# Altium schematic sheet 2025-565-V1.SchDoc
size A2; PageSetup: Record=PageOptions|CenterHorizontal=True|CenterVertical=True|PrintScale=0.52|XCorrection=1.00|YCorrection=1.00|PrintKind=0|BorderSize=5000000|LeftOffset=0|BottomOffset=0|Orientation=2|PaperLength=1000|PaperWidth=1000|Scale=100|PaperSource=7|PrintQuality=-3|MediaType=1|DitherType=10|PrintScaleMode=1|PaperKind=A4|PaperIndex=9
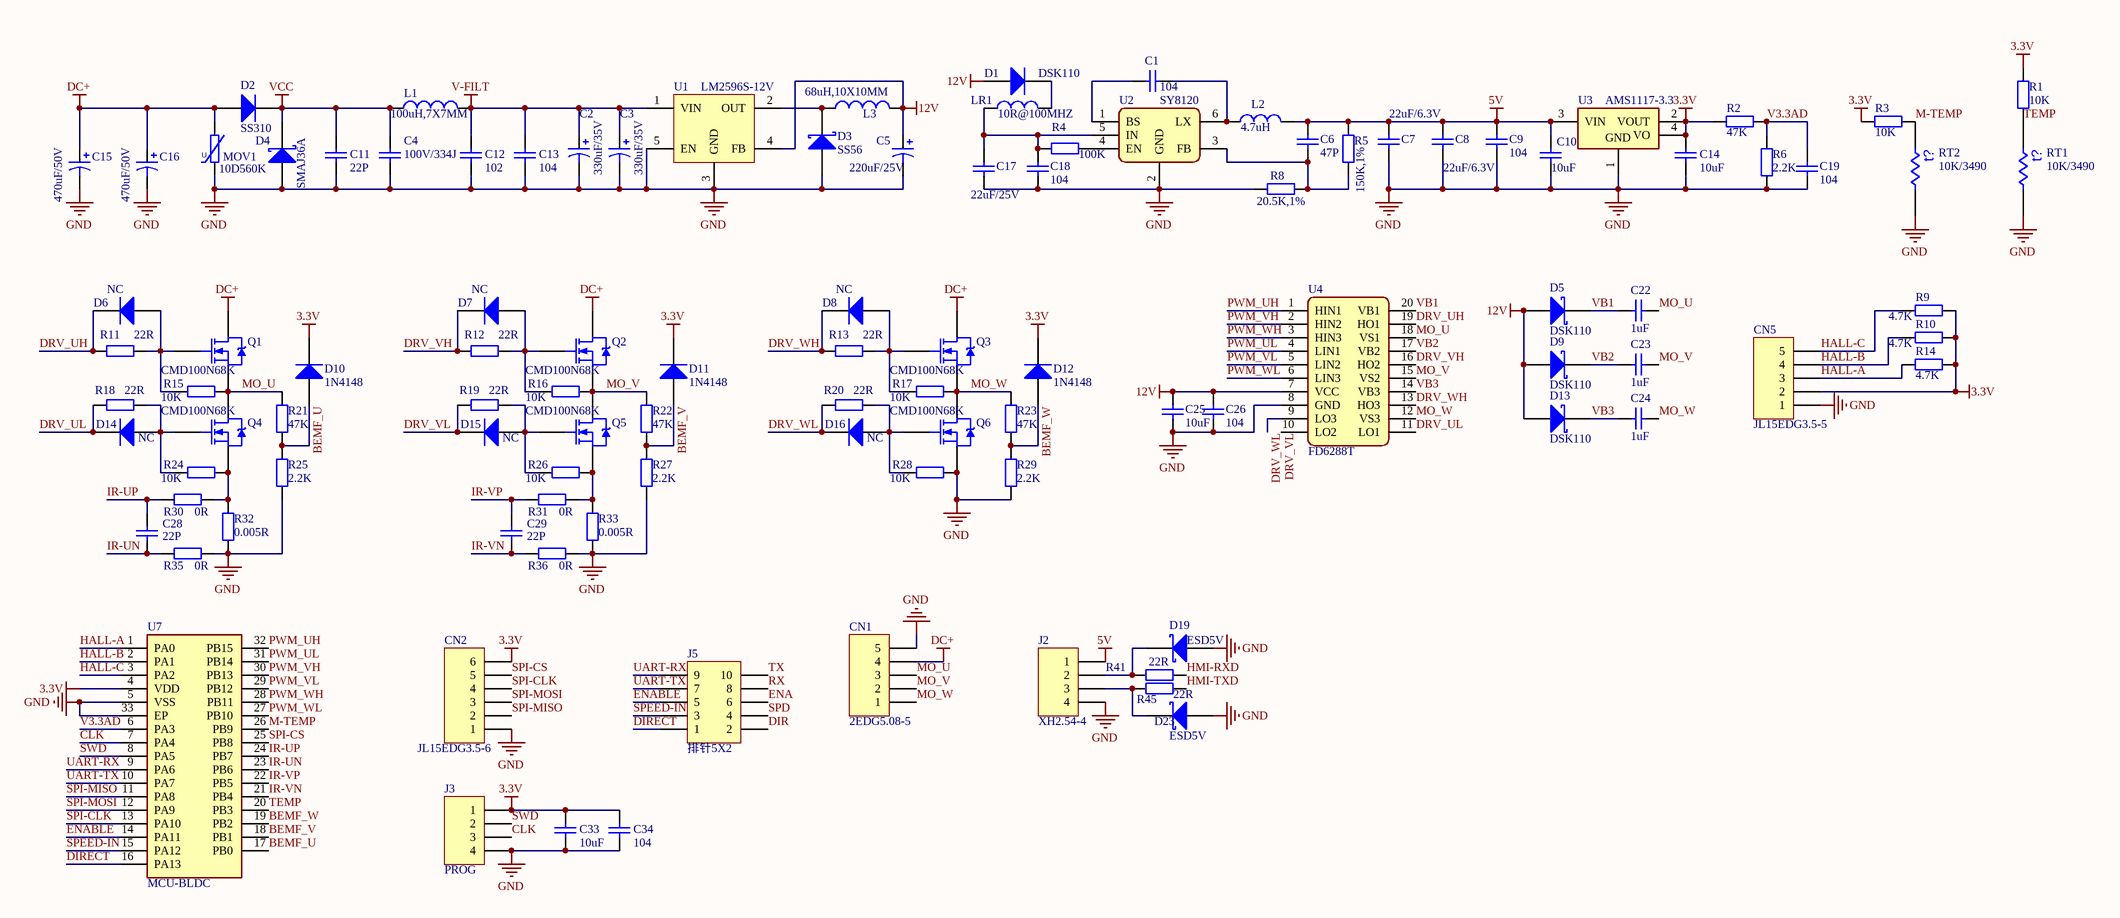
[diagram p0: 2025-565-V1.SchDoc]

## Parts
C1  104  [0603-C]
C2  330uF/35V  [EC10-V5]
C3  330uF/35V  [EC10-V5]
C4  100V/334J  [CAP5-7.2X7.5X3.5]
C5  220uF/25V  [CAP_63*77]
C6  47P  [0603-C]
C7  22uF/6.3V  [0603-C]
C8  22uF/6.3V  [0603-C]
C9  104  [0603-C]
C10  10uF  [0603-C]
C11  22P  [0603-C]
C12  102  [0603-C]
C13  104  [0603-C]
C14  10uF  [0603-C]
C15  470uF/50V  [EC10-V5]
C16  470uF/50V  [EC10-V5]
C17  22uF/25V  [1206-C]
C18  104  [0603-C]
C19  104  [0603-C]
C22  1uF  [0603-C]
C23  1uF  [0603-C]
C24  1uF  [0603-C]
C25  10uF  [1206-R]
C26  104  [0603-C]
C28  22P  [0603-C]
C29  22P  [0603-C]
C33  10uF  [0603-C]
C34  104  [0603-C]
CN1  2EDG5.08-5  [CON5_5.08MM_2EDG]
CN2  JL15EDG3.5-6  [CON3.5*6-H-SPEC]
CN5  JL15EDG3.5-5  [CON3.5*5-H-SPEC]
D1  DSK110  [SOD-123FL]
D2  SS310  [SMA-DO-214AC]
D3  SS56  [SMB_DO-214AA]
D4  SMAJ36A  [SMA-DO-214AC]
D5  DSK110  [SOD-123FL]
D6  NC  [SOD-123]
D7  NC  [SOD-123]
D8  NC  [SOD-123]
D9  DSK110  [SOD-123FL]
D10  1N4148  [SOD-123]
D11  1N4148  [SOD-123]
D12  1N4148  [SOD-123]
D13  DSK110  [SOD-123FL]
D14  NC  [SOD-123]
D15  NC  [SOD-123]
D16  NC  [SOD-123]
D19  ESD5V  [SOD-323]
D23  ESD5V  [SOD-323]
J2  XH2.54-4  [XH2.54_4]
J3  PROG  [HDR1X4]
J5  排针5X2  [HDR2X5]
L1  100uH,7X7MM  [L-7X7-2]
L2  4.7uH  [L-0420]
L3  68uH,10X10MM  [L-1050]
LR1  10R@100MHZ  [0603-R]
MOV1  10D560K  [RES-VAR-10D]
Q1  CMD100N68K  [TO-252]
Q2  CMD100N68K  [TO-252]
Q3  CMD100N68K  [TO-252]
Q4  CMD100N68K  [TO-252]
Q5  CMD100N68K  [TO-252]
Q6  CMD100N68K  [TO-252]
R1  10K  [0603-R]
R2  47K  [0603-R]
R3  10K  [0603-R]
R4  100K  [0603-R]
R5  150K,1%  [0603-R]
R6  2.2K  [0603-R]
R8  20.5K,1%  [0603-R]
R9  4.7K  [0603-R]
R10  4.7K  [0603-R]
R11  22R  [0603-R]
R12  22R  [0603-R]
R13  22R  [0603-R]
R14  4.7K  [0603-R]
R15  10K  [0603-R]
R16  10K  [0603-R]
R17  10K  [0603-R]
R18  22R  [0603-R]
R19  22R  [0603-R]
R20  22R  [0603-R]
R21  47K  [0603-R]
R22  47K  [0603-R]
R23  47K  [0603-R]
R24  10K  [0603-R]
R25  2.2K  [0603-R]
R26  10K  [0603-R]
R27  2.2K  [0603-R]
R28  10K  [0603-R]
R29  2.2K  [0603-R]
R30  0R  [0603-R]
R31  0R  [0603-R]
R32  0.005R  [RES2512]
R33  0.005R  [RES2512]
R35  0R  [0603-R]
R36  0R  [0603-R]
R41  22R  [0603-R]
R45  22R  [0603-R]
RT1  10K/3490  [0603-R]
RT2  10K/3490  [PAD0.7X2]
U1  LM2596S-12V  [TO-263-5]
U2  SY8120  [SOT23-6]
U3  AMS1117-3.3  [SOT-223]
U4  FD6288T  [TSSOP20]
U7  MCU-BLDC  [QFN32-EP-5X5]

## Nets
3.3V: C14.2 C33.2 C34.2 CN2.6 CN5.2 D10.2(K) D11.2(K) D12.2(K) J3.1 R1.2 R2.2 R3.2 R9.1 R10.1 R14.1 U3.2(VOUT) U3.4(VO) U7.4(VDD)
5V: C6.2 C7.2 C8.2 C9.2 C10.2 J2.1 L2.2 R5.2 U3.3(VIN)
12V: C5.1 C25.1 C26.1 D1.1(A) D5.1(A) D9.1(A) D13.1(A) L3.2 U1.4(FB) U4.7(VCC)
DC+: C15.1 C16.1 CN1.4 D2.1(A) MOV1.1 Q1.2(D) Q2.2(D) Q3.2(D)
GND: C2.2 C3.2 C4.1 C5.2 C7.1 C8.1 C9.1 C10.1 C11.1 C12.1 C13.1 C14.1 C15.2 C16.2 C17.2 C18.1 C19.1 C25.2 C26.2 C33.1 C34.1 CN1.5 CN2.1 CN5.1 D3.1(A) D4.1(A) D19.1(A) D23.1(A) J2.4 J3.4 MOV1.2 Q6.3(S) R6.2 R8.1 R25.1 R27.1 R28.2 R29.1 R32.1 R33.1 R35.1 R36.1 RT1.2 RT2.2 U1.3(GND) U1.5(EN) U2.2(GND) U3.1(GND) U4.8(GND) U7.5(VSS) U7.33(EP)
V-FILT: C2.1 C3.1 C12.2 C13.2 L1.2 U1.1(VIN)
VCC: C4.2 C11.2 D2.2(K) D4.2(K) L1.1
BEMF_U: D10.1(A) R21.1 R25.2 U7.17(PB0)
BEMF_V: D11.1(A) R22.1 R27.2 U7.18(PB1)
BEMF_W: D12.1(A) R23.1 R29.2 U7.19(PB2)
CLK: J3.3 U7.7(PA4)
DIR: J5.2
DIRECT: J5.1 U7.16(PA13)
DRV_UH: D6.2(K) R11.1 U4.19(HO1)
DRV_UL: D14.2(K) R18.1 U4.11(LO1)
DRV_VH: D7.2(K) R12.1 U4.16(HO2)
DRV_VL: D15.2(K) R19.1 U4.10(LO2)
DRV_WH: D8.2(K) R13.1 U4.13(HO3)
DRV_WL: D16.2(K) R20.1 U4.9(LO3)
ENA: J5.6
ENABLE: J5.5 U7.14(PA11)
HALL-A: CN5.3 R14.2 U7.1(PA0)
HALL-B: CN5.4 R10.2 U7.2(PA1)
HALL-C: CN5.5 R9.2 U7.3(PA2)
HMI-RXD: R41.1
HMI-TXD: R45.1
IR-UN: C28.1 R35.2 U7.23(PB6)
IR-UP: C28.2 R30.2 U7.24(PB7)
IR-VN: C29.1 R36.2 U7.21(PB4)
IR-VP: C29.2 R31.2 U7.22(PB5)
M-TEMP: R3.1 RT2.1 U7.26(PB9)
MO_U: C22.1 CN1.3 Q1.3(S) Q4.2(D) R15.2 R21.2 U4.18(VS1)
MO_V: C23.1 CN1.2 Q2.3(S) Q5.2(D) R16.2 R22.2 U4.15(VS2)
MO_W: C24.1 CN1.1 Q3.3(S) Q6.2(D) R17.2 R23.2 U4.12(VS3)
PWM_UH: U4.1(HIN1) U7.32(PB15)
PWM_UL: U4.4(LIN1) U7.31(PB14)
PWM_VH: U4.2(HIN2) U7.30(PB13)
PWM_VL: U4.5(LIN2) U7.29(PB12)
PWM_WH: U4.3(HIN3) U7.28(PB11)
PWM_WL: U4.6(LIN3) U7.27(PB10)
RX: J5.8
SPD: J5.4
SPEED-IN: J5.3 U7.15(PA12)
SPI-CLK: CN2.4 U7.13(PA10)
SPI-CS: CN2.5 U7.25(PB8)
SPI-MISO: CN2.2 U7.11(PA8)
SPI-MOSI: CN2.3 U7.12(PA9)
SWD: J3.2 U7.8(PA5)
TEMP: R1.1 RT1.1 U7.20(PB3)
TX: J5.10
UART-RX: J5.9 U7.9(PA6)
UART-TX: J5.7 U7.10(PA7)
V3.3AD: C19.2 R2.1 R6.1 U7.6(PA3)
VB1: C22.2 D5.2(K) U4.20(VB1)
VB2: C23.2 D9.2(K) U4.17(VB2)
VB3: C24.2 D13.2(K) U4.14(VB3)
NetC1_1: C1.1 U2.1(BS)
NetC1_2: C1.2 L2.1 U2.6(LX)
NetC6_1: C6.1 R5.1 R8.2 U2.3(FB)
NetC17_1: C17.1 C18.2 LR1.1 R4.1 U2.5(IN)
NetD1_2: D1.2(K) LR1.2
NetD3_2: D3.2(K) L3.1 U1.2(OUT)
NetD6_1: D6.1(A) Q1.1(G) R11.2 R15.1
NetD7_1: D7.1(A) Q2.1(G) R12.2 R16.1
NetD8_1: D8.1(A) Q3.1(G) R13.2 R17.1
NetD14_1: D14.1(A) Q4.1(G) R18.2 R24.1
NetD15_1: D15.1(A) Q5.1(G) R19.2 R26.1
NetD16_1: D16.1(A) Q6.1(G) R20.2 R28.1
NetD19_2: D19.2(K) J2.2 R41.2
NetD23_2: D23.2(K) J2.3 R45.2
NetQ4_3: Q4.3(S) R24.2 R30.1 R32.2
NetQ5_3: Q5.3(S) R26.2 R31.1 R33.2
NetR4_2: R4.2 U2.4(EN)

## Notes on the sheet
- (in symbol Res Thermal) t?
- (in symbol RES-VAR) U

## Library data of the parts
C1 C9 C13 C18 C19 = Cap: 0603电容; Published: 8-Jun-2000; LatestRevisionDate: 17-Jul-2002; LatestRevisionNote: Re-released for DXP Platform.; PackageReference: RAD-0.3; Publisher: Altium Limited; PackageDescription: Radial Cap, Thru-Hole; 2 Leads; 0.3 in Pin Spacing; Value: 104
C2 C3 C15 C16 = Cap Pol1: 插件电解电容; Value: 220uF; Published: 8-Jun-2000; LatestRevisionDate: 17-Jul-2002; LatestRevisionNote: Re-released for DXP Platform.; PackageReference: RB7.6-15; Publisher: Altium Limited; PackageDescription: Polarized Capacitor (Radial); 2 Leads
C4 = Cap: 校正电容; Value: 104; Published: 8-Jun-2000; LatestRevisionDate: 17-Jul-2002; LatestRevisionNote: Re-released for DXP Platform.; PackageReference: RAD-0.3; Publisher: Altium Limited; PackageDescription: Radial Cap, Thru-Hole; 2 Leads; 0.3 in Pin Spacing
C5 = Cap Pol1: 贴片电解电容; Value: 220uF; Published: 8-Jun-2000; LatestRevisionDate: 17-Jul-2002; LatestRevisionNote: Re-released for DXP Platform.; PackageReference: RB7.6-15; Publisher: Altium Limited; PackageDescription: Polarized Capacitor (Radial); 2 Leads
C6-C8 C11 C12 C28 C29 = Cap: 0603电容; Value: 104; Published: 8-Jun-2000; LatestRevisionDate: 17-Jul-2002; LatestRevisionNote: Re-released for DXP Platform.; PackageReference: RAD-0.3; Publisher: Altium Limited; PackageDescription: Radial Cap, Thru-Hole; 2 Leads; 0.3 in Pin Spacing
C10 = Cap: 0603电容; Value: NC; Published: 8-Jun-2000; LatestRevisionDate: 17-Jul-2002; LatestRevisionNote: Re-released for DXP Platform.; PackageReference: RAD-0.3; Publisher: Altium Limited; PackageDescription: Radial Cap, Thru-Hole; 2 Leads; 0.3 in Pin Spacing
C14 C33 C34 = Cap: 0603电容; Value: 22uF; Published: 8-Jun-2000; LatestRevisionDate: 17-Jul-2002; LatestRevisionNote: Re-released for DXP Platform.; PackageReference: RAD-0.3; Publisher: Altium Limited; PackageDescription: Radial Cap, Thru-Hole; 2 Leads; 0.3 in Pin Spacing
C17 = Cap: 1206电容; Value: 4.7uF; Published: 8-Jun-2000; LatestRevisionDate: 17-Jul-2002; LatestRevisionNote: Re-released for DXP Platform.; PackageReference: RAD-0.3; Publisher: Altium Limited; PackageDescription: Radial Cap, Thru-Hole; 2 Leads; 0.3 in Pin Spacing
C22-C24 C26 = Cap: 0603电容; Value: 100pF; Published: 8-Jun-2000; LatestRevisionDate: 17-Jul-2002; LatestRevisionNote: Re-released for DXP Platform.; PackageReference: RAD-0.3; Publisher: Altium Limited; PackageDescription: Radial Cap, Thru-Hole; 2 Leads; 0.3 in Pin Spacing
C25 = Cap: 1206电容; Value: 100pF; Published: 8-Jun-2000; LatestRevisionDate: 17-Jul-2002; LatestRevisionNote: Re-released for DXP Platform.; PackageReference: RAD-0.3; Publisher: Altium Limited; PackageDescription: Radial Cap, Thru-Hole; 2 Leads; 0.3 in Pin Spacing
CN1 CN5 = Header 5: 插拔端子; LatestRevisionDate: 17-Jul-2002; LatestRevisionNote: Re-released for DXP Platform.; Publisher: Altium Limited
CN2 = Header 6: 插拔端子; LatestRevisionDate: 17-Jul-2002; LatestRevisionNote: Re-released for DXP Platform.; Publisher: Altium Limited
D1 D2 = Diode: 二极管; Published: 8-Jun-2000; LatestRevisionDate: 17-Jul-2002; LatestRevisionNote: Re-released for DXP Platform.; PackageVersion: Sep-1996; PackageReference: SMC; Publisher: Altium Limited; PackageDescription: DO-214-AB/SMC; 2 C-Bend Leads; Body 7.9 x 5.9 mm, inc. leads (LxW); Code_JEDEC: DO-214-AB
D3 D5 D9 D13 = D Schottky: 肖特基二极管; Published: 8-Jun-2000; LatestRevisionDate: 17-Jul-2002; LatestRevisionNote: Re-released for DXP Platform.; PackageReference: SMB; Publisher: Altium Limited; PackageDescription: DO-214-AA/SMB; 2 C-Bend Leads; Body 5.3 x 3.6 mm, inc. leads (LxW); Code_JEDEC: DO-214-AA
D4 D19 D23 = D Schottky: TVS二极管; Published: 8-Jun-2000; LatestRevisionDate: 17-Jul-2002; LatestRevisionNote: Re-released for DXP Platform.; PackageReference: SMB; Publisher: Altium Limited; PackageDescription: DO-214-AA/SMB; 2 C-Bend Leads; Body 5.3 x 3.6 mm, inc. leads (LxW); Code_JEDEC: DO-214-AA
D6-D8 D10-D12 D14-D16 = Diode: Default Diode; Published: 8-Jun-2000; LatestRevisionDate: 17-Jul-2002; LatestRevisionNote: Re-released for DXP Platform.; PackageVersion: Sep-1996; PackageReference: SMC; Publisher: Altium Limited; PackageDescription: DO-214-AB/SMC; 2 C-Bend Leads; Body 7.9 x 5.9 mm, inc. leads (LxW); Code_JEDEC: DO-214-AB
J2 = Header 4: XH连接器; LatestRevisionDate: 17-Jul-2002; LatestRevisionNote: Re-released for DXP Platform.; Publisher: Altium Limited
J3 = Header 4: NC; LatestRevisionDate: 17-Jul-2002; LatestRevisionNote: Re-released for DXP Platform.; Publisher: Altium Limited
J5 = Header 5X2: 排针; LatestRevisionDate: 17-Jul-2002; LatestRevisionNote: Re-released for DXP Platform.; Publisher: Altium Limited
L1 = Inductor: 贴片电感; Code_IEC: 1005; Value: 68uH; Published: 8-Jun-2000; LatestRevisionDate: 29-May-2009; LatestRevisionNote: IPC-7351 Footprint Added.; PackageReference: 0402-A; Publisher: Altium Limited; PackageDescription: Chip Inductor; Code_JEITA: 0402
L2 = L: 一体成型电感
L3 = Inductor: 贴片功率电感; Code_IEC: 1005; Published: 8-Jun-2000; LatestRevisionDate: 29-May-2009; LatestRevisionNote: IPC-7351 Footprint Added.; PackageReference: 0402-A; Publisher: Altium Limited; PackageDescription: Chip Inductor; Code_JEITA: 0402; Value: 68uH
LR1 = L: 0603磁珠
MOV1 = RES-VAR: 压敏电阻
Q1-Q6 = NMOS-2: N-Channel Power MOSFET; Note: Pin 2 is electrically connected to pin 4.; Published: 8-Jun-2000; LatestRevisionDate: 17-Jul-2002; LatestRevisionNote: Re-released for DXP Platform.; DatasheetVersion: PD-9.814; PackageVersion: Feb-1997; PackageReference: TO-220AB; Publisher: Altium Limited; PackageDescription: TO, Thru-Hole, Vertical, Heatsink Mounted; 3 In-Line Leads; Pitch 2.54 mm; ComponentLink1Description: Manufacturer Link; ComponentLink1URL: http://www.irf.com/
R1 = Res2: 0603电阻; Value: 47; Published: 8-Jun-2000; LatestRevisionDate: 17-Jul-2002; LatestRevisionNote: Re-released for DXP Platform.; PackageReference: AXIAL-0.4; Publisher: Altium Limited; PackageDescription: Axial Device, Thru-Hole; 2 Leads; 0.4 in Pin Spacing
R2 R4-R6 R8-R14 R18-R23 R25 R27 R29-R31 R35 R36 = Res2: 0603电阻; Value: 10K; Published: 8-Jun-2000; LatestRevisionDate: 17-Jul-2002; LatestRevisionNote: Re-released for DXP Platform.; PackageReference: AXIAL-0.4; Publisher: Altium Limited; PackageDescription: Axial Device, Thru-Hole; 2 Leads; 0.4 in Pin Spacing
R3 R15-R17 R24 R26 R28 = Res2: 0603电阻; Published: 8-Jun-2000; LatestRevisionDate: 17-Jul-2002; LatestRevisionNote: Re-released for DXP Platform.; PackageReference: AXIAL-0.4; Publisher: Altium Limited; PackageDescription: Axial Device, Thru-Hole; 2 Leads; 0.4 in Pin Spacing; Value: 10K
R32 R33 = Res2: 2512合金电阻; Value: 10K; Published: 8-Jun-2000; LatestRevisionDate: 17-Jul-2002; LatestRevisionNote: Re-released for DXP Platform.; PackageReference: AXIAL-0.4; Publisher: Altium Limited; PackageDescription: Axial Device, Thru-Hole; 2 Leads; 0.4 in Pin Spacing
R41 R45 = Res2: 0603电阻; Value: 1K; Published: 8-Jun-2000; LatestRevisionDate: 17-Jul-2002; LatestRevisionNote: Re-released for DXP Platform.; PackageReference: AXIAL-0.4; Publisher: Altium Limited; PackageDescription: Axial Device, Thru-Hole; 2 Leads; 0.4 in Pin Spacing
RT1 RT2 = Res Thermal: 热敏电阻; Published: 24-Mar-1999; LatestRevisionDate: 29-May-2009; LatestRevisionNote: IPC-7351 Footprint Added.; PackageVersion: Mar-2003; PackageReference: 6-0805; Publisher: Altium Limited; PackageDescription: Chip Resistor 0805 Case Size; Code_IPC: RESC2012
U1 = LM2596: DC-DC降压芯片
U2 = SY8120: DC-DC降压芯片
U3 = AMS1117: LDO稳压器
U4 = FD6288T: 全桥栅极驱动器
U7 = MCU-BLDC: MCU; Note: 纠偏机定制无刷主控芯片